# Altium schematic sheet SEDRA HPN.SchDoc
size A4
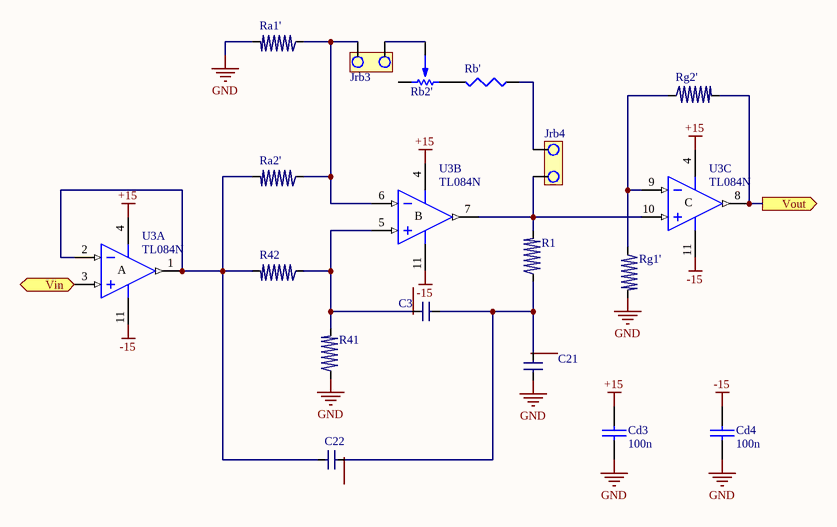
[diagram p0: SEDRA HPN.SchDoc]

## Parts
C3  (no value)  [Model Name]
C21  (no value)
C22  (no value)  [Model Name]
Cd3  100n  [CAP200]
Cd4  100n  [CAP200]
Jrb3  (no value)  [JUMPER2]
Jrb4  (no value)  [JUMPER2]
R1  (no value)  [PCBComponent_1]
R41  (no value)  [PCBComponent_1]
R42  (no value)  [PCBComponent_1]
Ra1'  (no value)  [PCBComponent_1]
Ra2'  (no value)  [PCBComponent_1]
Rb2'  (no value)  [PRESET V]
Rb'  (no value)  [RES400]
Rg1'  (no value)  [PCBComponent_1]
Rg2'  (no value)  [PCBComponent_1]
U3  TL084N  [N014]  (parts A,B,C of 4)

## Ports
Vin (in), Vout (out)

## Nets
+15: Cd3.1 U3.4(V+)
-15: Cd4.1 U3.11(V-)
GND: C21.1 Cd3.2 Cd4.2 R41.2 Ra1'.1 Rg1'.1
Vin: U3.3(IN+) ; port Vin
Vout: Rg2'.1 U3.8(OUT) ; port Vout
NetC3_1: C3.1 C21.2 C22.2 R1.2
NetC3_2: C3.2 R41.1 R42.2 U3.5(IN+)
NetC22_1: C22.1 R42.1 Ra2'.1 U3.1(OUT) U3.2(IN-)
NetJrb3_1: Jrb3.1 Ra1'.2 Ra2'.2 U3.6(IN-)
NetJrb3_2: Jrb3.2 Rb2'.2
NetJrb4_1: Jrb4.1 R1.1 U3.7(OUT) U3.10(IN+)
NetJrb4_2: Jrb4.2 Rb'.1
NetRb2'_3: Rb2'.3 Rb'.2
NetRg1'_2: Rg1'.2 Rg2'.2 U3.9(IN-)

Not connected (* = marked no-connect by the designer): Rb2' 1

## Notes on the sheet
- (in symbol TL084N, part A) A
- (in symbol TL084N, part B) B
- (in symbol TL084N, part C) C

## Library data of the parts
C3 C21 C22 = Sheet1
Cd3 Cd4 = CAP
Jrb3 Jrb4 = JUMPER
R1 R41 R42 Ra1' Ra2' Rg1' Rg2' = SPres
Rb2' = PRESET
Rb' = Res3: Resistor; Published: 8-Jun-2000; LatestRevisionDate: 29-May-2009; LatestRevisionNote: IPC-7351 Footprint Added.; PackageReference: J1-0603; Publisher: Altium Limited; PackageDescription: Chip Resistor
U3 = TL084N: JFET-Input Operational Amplifier; Published: 16-Jan-2001; LatestRevisionDate: 04-Mar-2005; LatestRevisionNote: Stylized 3D Model Added.; DatasheetVersion: Feb-1999; PackageVersion: Oct-1995; PackageReference: N014; Publisher: Altium Limited; PackageDescription: DIP; 14 Leads; Row Spacing 7.62 mm; Pitch 2.54 mm; ComponentLink1Description: Manufacturer Link; ComponentLink1URL: http://www.ti.com/; ComponentLink2Description: Datasheet; ComponentLink2URL: http://www-s.ti.com/sc/ds/tl084.pdf